# Altium project AudioUSB.PrjPcb
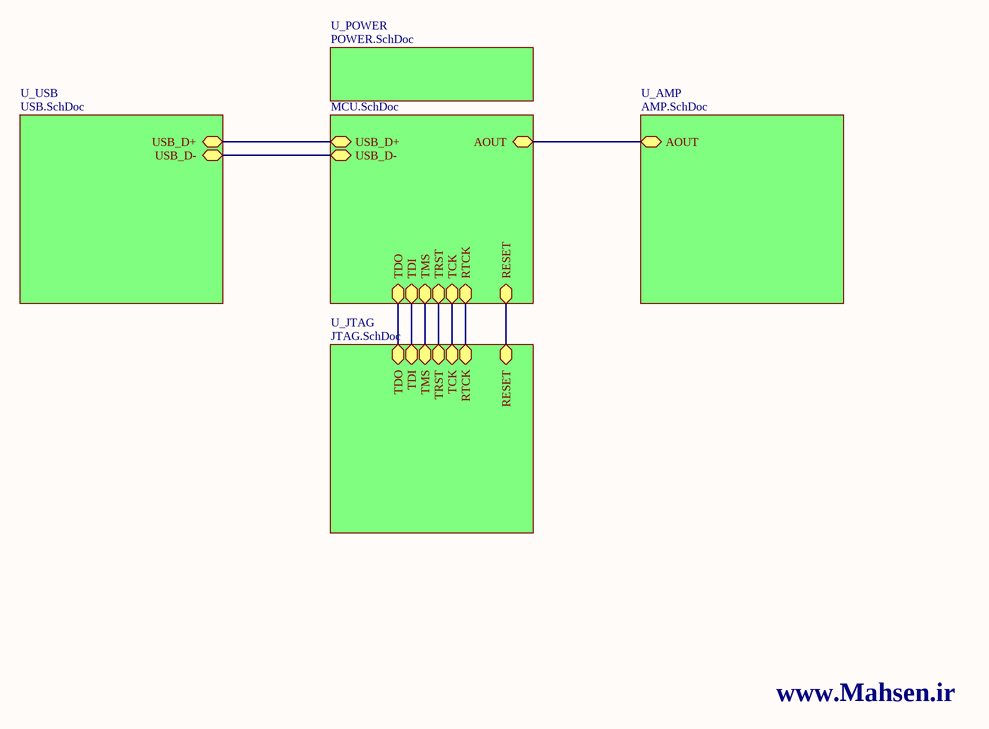
[diagram p0: TopSheet.SchDoc]
6 sheets, 41 parts. Net scope: hierarchical (ports join the sheet entries above them; power ports are global).
Board file: MainPCB.PcbDoc
Sheets:
  TopSheet.SchDoc
    U_AMP = AMP.SchDoc
    U_JTAG = JTAG.SchDoc
    U_MCU = MCU.SchDoc
    U_POWER = POWER.SchDoc
    U_USB = USB.SchDoc

## Sheet TopSheet.SchDoc
size A

### Sub-sheets
U_AMP = AMP.SchDoc: AOUT (bidir)
U_JTAG = JTAG.SchDoc: TDO (bidir), TDI (bidir), TMS (bidir), TRST (bidir), TCK (bidir), RTCK (bidir), RESET (bidir)
U_MCU = MCU.SchDoc: AOUT (bidir), USB_D+ (bidir), USB_D- (bidir), TDO (bidir), TDI (bidir), TMS (bidir), TRST (bidir), TCK (bidir), RTCK (bidir), RESET (bidir)
U_POWER = POWER.SchDoc: no entries
U_USB = USB.SchDoc: USB_D+ (bidir), USB_D- (bidir)

### Nets
NetC1_2: sheet U_AMP/AOUT, sheet U_MCU/AOUT
NetC5_1: sheet U_JTAG/RESET, sheet U_MCU/RESET
NetC17_2: sheet U_MCU/USB_D-, sheet U_USB/USB_D-
NetC18_1: sheet U_MCU/USB_D+, sheet U_USB/USB_D+
NetCN1_3: sheet U_JTAG/TRST, sheet U_MCU/TRST
NetCN1_5: sheet U_JTAG/TDI, sheet U_MCU/TDI
NetCN1_7: sheet U_JTAG/TMS, sheet U_MCU/TMS
NetCN1_9: sheet U_JTAG/TCK, sheet U_MCU/TCK
NetCN1_11: sheet U_JTAG/RTCK, sheet U_MCU/RTCK
NetCN1_13: sheet U_JTAG/TDO, sheet U_MCU/TDO

### Notes on the sheet
- www.Mahsen.ir

## Sheet AMP.SchDoc
size A
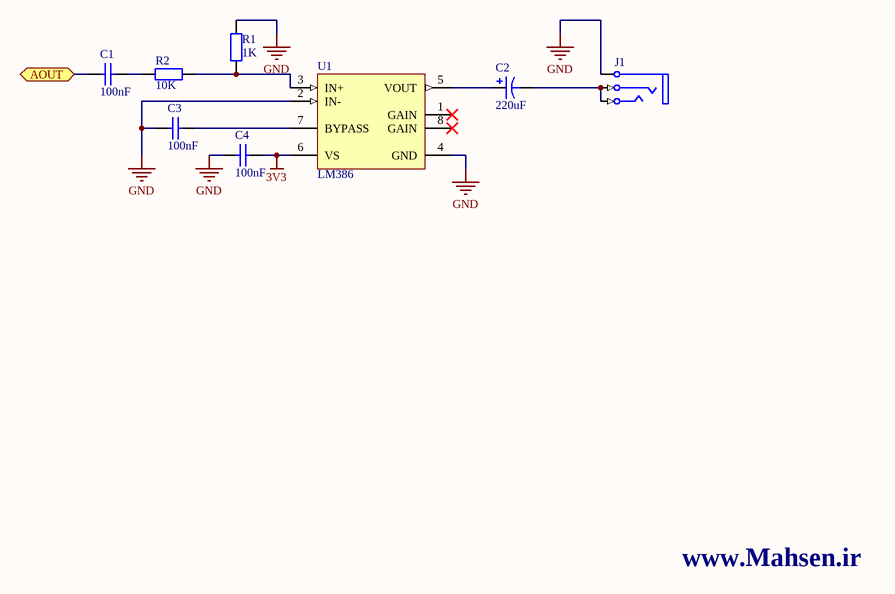
[diagram p1: AMP.SchDoc]

### Parts
C1  100nF  [0805]
C2  220uF  [CAPR5-4X5]
C3  100nF  [0805]
C4  100nF  [0805]
J1  Phonejack3  [KLD-0202]  (value not drawn)
R1  1K  [0805]
R2  10K  [0805]
U1  LM386  [M08A_L]

### Ports
AOUT (bidir)

### Nets
3V3: C4.1 U1.6(VS)
GND: C3.2 C4.2 J1.5(S) R1.2 U1.2(IN-) U1.4(GND)
NetC1_1: C1.1 R2.1
NetC1_2: C1.2 ; port AOUT
NetC2_1: C2.1 U1.5(VOUT)
NetC2_2: C2.2 J1.1(T) J1.3(R)
NetC3_1: C3.1 U1.7(BYPASS)
NetR1_1: R1.1 R2.2 U1.3(IN+)

Not connected (* = marked no-connect by the designer): U1 1(GAIN)* 8(GAIN)*

### Notes on the sheet
- www.Mahsen.ir

### Library data of the parts
C1 C3 C4 = Cap: Capacitor; Published: 8-Jun-2000; LatestRevisionDate: 17-Jul-2002; LatestRevisionNote: Re-released for DXP Platform.; PackageReference: RAD-0.3; Publisher: Altium Limited; PackageDescription: Radial Cap, Thru-Hole; 2 Leads; 0.3 in Pin Spacing; Value: 100nF
C2 = Cap Pol3: Polarized Capacitor (Surface Mount); Published: 8-Jun-2000; LatestRevisionDate: 29-May-2009; LatestRevisionNote: IPC-7351 Footprint Added.; PackageReference: C0805; Publisher: Altium Limited; PackageDescription: Chip Capacitor; Value: 220uF
J1 = Phonejack3: Jack Socket, 1/4" [6.5mm], Thru-Hole, Vertical, 3-Conductor Open Circuit (Non-Normalling); PackageDocument: 2003; PCB_Layout: Complies with manufacturer's recommendation.; DrillAndSlotSize: Corresponds to nominal value.; Published: 15-Jul-2004; LatestRevisionDate: 15-Jul-2004; LatestRevisionNote: Component Replaced.; DatasheetDocument: 2003; PackageReference: S1VS_SSS; Publisher: Altium Limited; ComponentLink1Description: Manufacturer Link; ComponentLink1URL: http://www.cliffuk.co.uk/
R1 R2 = Res2: Resistor; Published: 8-Jun-2000; LatestRevisionDate: 17-Jul-2002; LatestRevisionNote: Re-released for DXP Platform.; PackageReference: AXIAL-0.4; Publisher: Altium Limited; PackageDescription: Axial Device, Thru-Hole; 2 Leads; 0.4 in Pin Spacing
  R1: Value: 1K
  R2: Value: 10K
U1 = LM386MX-1: Low Voltage Audio Power Amplifier, 8-pin Narrow SOIC; Manufacturer: National Semiconductor; PackageTopMarking: NSZXTT*LM386*M-1; PowerWise: N; CompType: Audio IC; Published: 1-Mar-2010; DatasheetVersion: Aug-2000; PackageVersion: revM, May-2009; PackageReference: M08A; Publisher: Altium Limited; PackageDescription: SOIC Narrow, 4.9 x 3.9 x 1.45mm, 8 Lead, 1.27mm Pitch; PartNumber: LM386MX-1; RoHS: N; PinCount: 8; Code_JEDEC: MS-012-AA; Code_IPC: SOIC127P600-8; ComponentLink1Description: LM386 Datasheet; ComponentLink1URL: http://www.national.com/ds/LM/LM386.pdf; ComponentLink2Description: LM386 Web Page; ComponentLink2URL: http://www.national.com/pf/LM/LM386.html; ComponentLink3Description: M08A Package Page; ComponentLink3URL: http://www.national.com/packaging/folders/m08a.html

## Sheet JTAG.SchDoc
size A
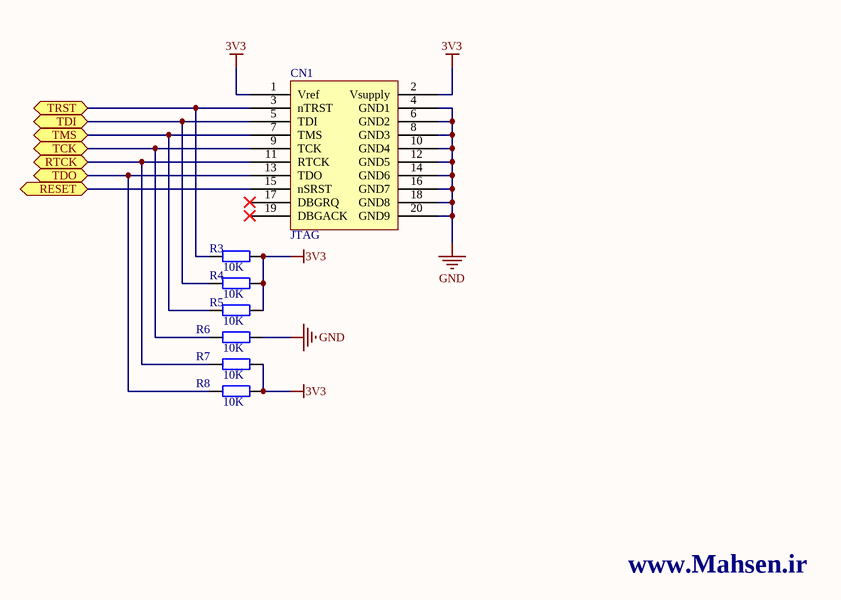
[diagram p2: JTAG.SchDoc]

### Parts
CN1  JTAG  [FKV20SN]
R3  10K  [0805]
R4  10K  [0805]
R5  10K  [0805]
R6  10K  [0805]
R7  10K  [0805]
R8  10K  [0805]

### Ports
RESET (bidir), RTCK (bidir), TCK (bidir), TDI (bidir), TDO (bidir), TMS (bidir), TRST (bidir)

### Nets
3V3: CN1.1(Vref) CN1.2(Vsupply) R3.1 R4.1 R5.1 R7.1 R8.1
GND: CN1.4(GND1) CN1.6(GND2) CN1.8(GND3) CN1.10(GND4) CN1.12(GND5) CN1.14(GND6) CN1.16(GND7) CN1.18(GND8) CN1.20(GND9) R6.1
NetC5_1: CN1.15(nSRST) ; port RESET
NetCN1_3: CN1.3(nTRST) R3.2 ; port TRST
NetCN1_5: CN1.5(TDI) R4.2 ; port TDI
NetCN1_7: CN1.7(TMS) R5.2 ; port TMS
NetCN1_9: CN1.9(TCK) R6.2 ; port TCK
NetCN1_11: CN1.11(RTCK) R7.2 ; port RTCK
NetCN1_13: CN1.13(TDO) R8.2 ; port TDO

Not connected (* = marked no-connect by the designer): CN1 17(DBGRQ)* 19(DBGACK)*

### Notes on the sheet
- www.Mahsen.ir

### Library data of the parts
R3-R8 = Res2: Resistor; Published: 8-Jun-2000; LatestRevisionDate: 17-Jul-2002; LatestRevisionNote: Re-released for DXP Platform.; PackageReference: AXIAL-0.4; Publisher: Altium Limited; PackageDescription: Axial Device, Thru-Hole; 2 Leads; 0.4 in Pin Spacing; Value: 10K

## Sheet MCU.SchDoc
size A4
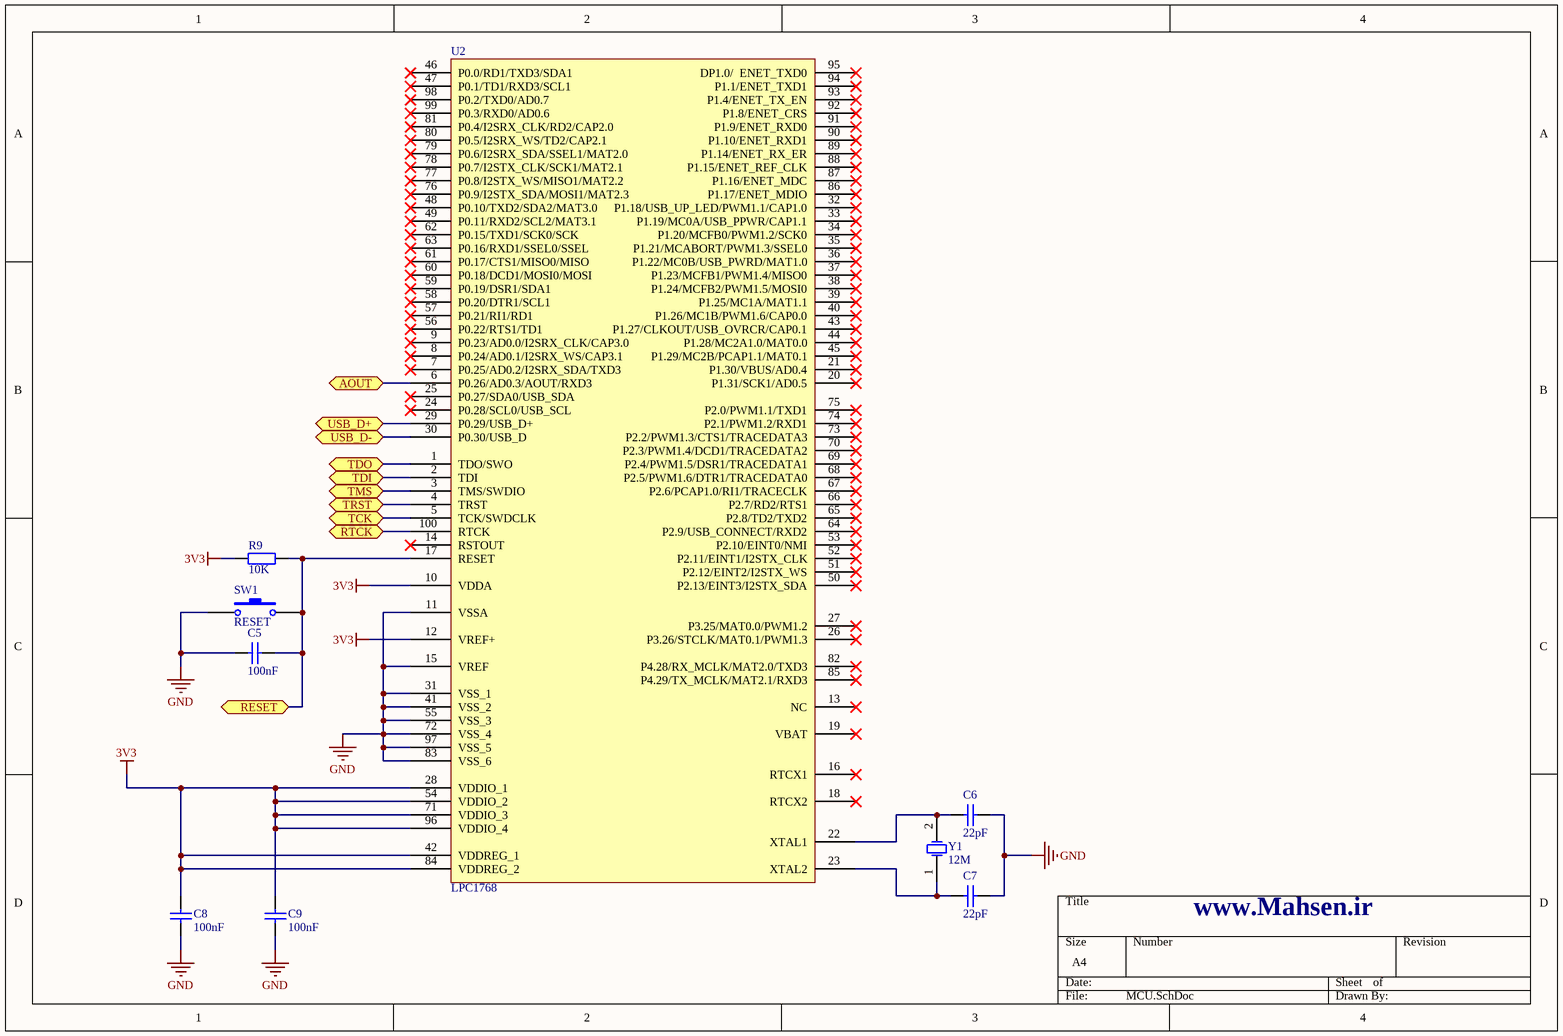
[diagram p3: MCU.SchDoc]

### Parts
C5  100nF  [0805]
C6  22pF  [0805]
C7  22pF  [0805]
C8  100nF  [0805]
C9  100nF  [0805]
R9  10K  [0805]
SW1  RESET  [SPST-2]
U2  LPC1768  [LQFP_100]
Y1  12M  [XTALA]

### Ports
AOUT (bidir), RESET (bidir), RTCK (bidir), TCK (bidir), TDI (bidir), TDO (bidir), TMS (bidir), TRST (bidir), USB_D+ (bidir), USB_D- (bidir)

### Nets
3V3: C8.1 C9.1 R9.1 U2.10(VDDA) U2.12(VREF+) U2.28(VDDIO_1) U2.42(VDDREG_1) U2.54(VDDIO_2) U2.71(VDDIO_3) U2.84(VDDREG_2) U2.96(VDDIO_4)
GND: C5.2 C6.2 C7.1 C8.2 C9.2 SW1.1 U2.11(VSSA) U2.15(VREF) U2.31(VSS_1) U2.41(VSS_2) U2.55(VSS_3) U2.72(VSS_4) U2.83(VSS_6) U2.97(VSS_5)
NetC1_2: U2.6(P0.26/AD0.3/AOUT/RXD3) ; port AOUT
NetC5_1: C5.1 R9.2 SW1.2 U2.17(RESET) ; port RESET
NetC6_1: C6.1 U2.22(XTAL1) Y1.2(OSC2)
NetC7_2: C7.2 U2.23(XTAL2) Y1.1(OSC1)
NetC17_2: U2.30(P0.30/USB_D) ; port USB_D-
NetC18_1: U2.29(P0.29/USB_D+) ; port USB_D+
NetCN1_3: U2.4(TRST) ; port TRST
NetCN1_5: U2.2(TDI) ; port TDI
NetCN1_7: U2.3(TMS/SWDIO) ; port TMS
NetCN1_9: U2.5(TCK/SWDCLK) ; port TCK
NetCN1_11: U2.100(RTCK) ; port RTCK
NetCN1_13: U2.1(TDO/SWO) ; port TDO

Not connected (* = marked no-connect by the designer): U2 7(P0.25/AD0.2/I2SRX_SDA/TXD3)* 8(P0.24/AD0.1/I2SRX_WS/CAP3.1)* 9(P0.23/AD0.0/I2SRX_CLK/CAP3.0)* 13(NC)* 14(RSTOUT)* 16(RTCX1)* 18(RTCX2)* 19(VBAT)* 20(P1.31/SCK1/AD0.5)* 21(P1.30/VBUS/AD0.4)* 24(P0.28/SCL0/USB_SCL)* 25(P0.27/SDA0/USB_SDA)* 26(P3.26/STCLK/MAT0.1/PWM1.3)* 27(P3.25/MAT0.0/PWM1.2)* 32(P1.18/USB_UP_LED/PWM1.1/CAP1.0)* 33(P1.19/MC0A/USB_PPWR/CAP1.1)* 34(P1.20/MCFB0/PWM1.2/SCK0)* 35(P1.21/MCABORT/PWM1.3/SSEL0)* 36(P1.22/MC0B/USB_PWRD/MAT1.0)* 37(P1.23/MCFB1/PWM1.4/MISO0)* 38(P1.24/MCFB2/PWM1.5/MOSI0)* 39(P1.25/MC1A/MAT1.1)* 40(P1.26/MC1B/PWM1.6/CAP0.0)* 43(P1.27/CLKOUT/USB_OVRCR/CAP0.1)* 44(P1.28/MC2A1.0/MAT0.0)* 45(P1.29/MC2B/PCAP1.1/MAT0.1)* 46(P0.0/RD1/TXD3/SDA1)* 47(P0.1/TD1/RXD3/SCL1)* 48(P0.10/TXD2/SDA2/MAT3.0)* 49(P0.11/RXD2/SCL2/MAT3.1)* 50(P2.13/EINT3/I2STX_SDA)* 51(P2.12/EINT2/I2STX_WS)* 52(P2.11/EINT1/I2STX_CLK)* 53(P2.10/EINT0/NMI)* 56(P0.22/RTS1/TD1)* 57(P0.21/RI1/RD1)* 58(P0.20/DTR1/SCL1)* 59(P0.19/DSR1/SDA1)* 60(P0.18/DCD1/MOSI0/MOSI)* 61(P0.17/CTS1/MISO0/MISO)* 62(P0.15/TXD1/SCK0/SCK)* 63(P0.16/RXD1/SSEL0/SSEL)* 64(P2.9/USB_CONNECT/RXD2)* 65(P2.8/TD2/TXD2)* 66(P2.7/RD2/RTS1)* 67(P2.6/PCAP1.0/RI1/TRACECLK)* 68(P2.5/PWM1.6/DTR1/TRACEDATA0)* 69(P2.4/PWM1.5/DSR1/TRACEDATA1)* 70(P2.3/PWM1.4/DCD1/TRACEDATA2)* 73(P2.2/PWM1.3/CTS1/TRACEDATA3)* 74(P2.1/PWM1.2/RXD1)* 75(P2.0/PWM1.1/TXD1)* 76(P0.9/I2STX_SDA/MOSI1/MAT2.3)* 77(P0.8/I2STX_WS/MISO1/MAT2.2)* 78(P0.7/I2STX_CLK/SCK1/MAT2.1)* 79(P0.6/I2SRX_SDA/SSEL1/MAT2.0)* 80(P0.5/I2SRX_WS/TD2/CAP2.1)* 81(P0.4/I2SRX_CLK/RD2/CAP2.0)* 82(P4.28/RX_MCLK/MAT2.0/TXD3)* 85(P4.29/TX_MCLK/MAT2.1/RXD3)* 86(P1.17/ENET_MDIO)* 87(P1.16/ENET_MDC)* 88(P1.15/ENET_REF_CLK)* 89(P1.14/ENET_RX_ER)* 90(P1.10/ENET_RXD1)* 91(P1.9/ENET_RXD0)* 92(P1.8/ENET_CRS)* 93(P1.4/ENET_TX_EN)* 94(P1.1/ENET_TXD1)* 95(DP1.0/__ENET_TXD0)* 98(P0.2/TXD0/AD0.7)* 99(P0.3/RXD0/AD0.6)*

### Notes on the sheet
- www.Mahsen.ir

### Library data of the parts
C5-C9 = Cap: Capacitor; Published: 8-Jun-2000; LatestRevisionDate: 17-Jul-2002; LatestRevisionNote: Re-released for DXP Platform.; PackageReference: RAD-0.3; Publisher: Altium Limited; PackageDescription: Radial Cap, Thru-Hole; 2 Leads; 0.3 in Pin Spacing
  C5 C8 C9: Value: 100nF
  C6 C7: Value: 22pF
R9 = Res2: Resistor; Published: 8-Jun-2000; LatestRevisionDate: 17-Jul-2002; LatestRevisionNote: Re-released for DXP Platform.; PackageReference: AXIAL-0.4; Publisher: Altium Limited; PackageDescription: Axial Device, Thru-Hole; 2 Leads; 0.4 in Pin Spacing; Value: 10K
SW1 = SW-PB: Switch; Published: 24-Mar-1999; LatestRevisionDate: 17-Jul-2002; LatestRevisionNote: Re-released for DXP Platform.; PackageReference: SPST-2; Publisher: Altium Limited; PackageDescription: Switch; 2 Leads
Y1 = XTAL: Crystal Oscillator; Published: 8-Jun-2000; LatestRevisionDate: 17-Jul-2002; LatestRevisionNote: Re-released for DXP Platform.; PackageReference: R38; Publisher: Altium Limited; PackageDescription: Crystal, Thru-Hole; 2 Leads; Body 3.1 x 8.2 mm (Dia.xH); Value: 12M

## Sheet POWER.SchDoc
size A
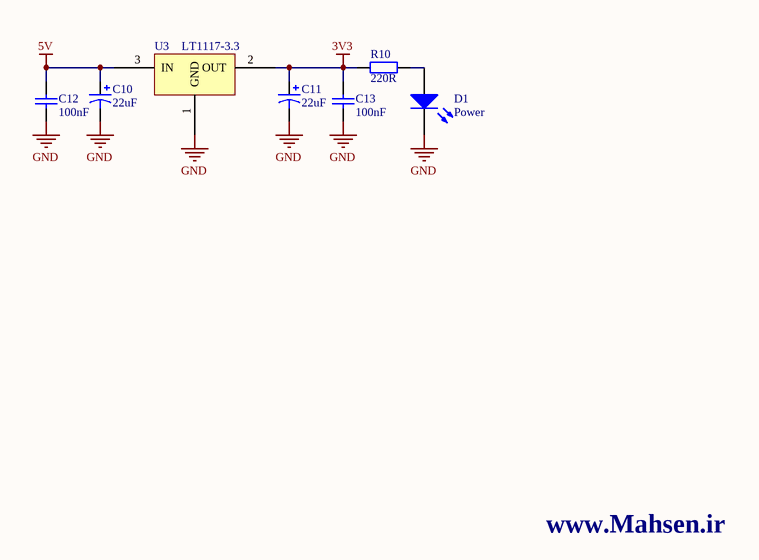
[diagram p4: POWER.SchDoc]

### Parts
C10  22uF  [CAPR5-4X5]
C11  22uF  [CAPR5-4X5]
C12  100nF  [0805]
C13  100nF  [0805]
D1  Power  [3.5X2.8X1.9]
R10  220R  [0805]
U3  LT1117-3.3  [SOT223_4]

### Nets
3V3: C11.1 C13.1 R10.1 U3.2(OUT)
5V: C10.1 C12.1 U3.3(IN)
GND: C10.2 C11.2 C12.2 C13.2 D1.2(K) U3.1(GND)
NetD1_1: D1.1(A) R10.2

### Notes on the sheet
- www.Mahsen.ir

### Library data of the parts
C10 C11 = Cap Pol3: Polarized Capacitor (Surface Mount); Published: 8-Jun-2000; LatestRevisionDate: 29-May-2009; LatestRevisionNote: IPC-7351 Footprint Added.; PackageReference: C0805; Publisher: Altium Limited; PackageDescription: Chip Capacitor; Value: 22uF
C12 C13 = Cap: Capacitor; Published: 8-Jun-2000; LatestRevisionDate: 17-Jul-2002; LatestRevisionNote: Re-released for DXP Platform.; PackageReference: RAD-0.3; Publisher: Altium Limited; PackageDescription: Radial Cap, Thru-Hole; 2 Leads; 0.3 in Pin Spacing; Value: 100nF
D1 = LED3: Typical BLUE SiC LED; Published: 8-Jun-2000; LatestRevisionDate: 17-Dec-2003; LatestRevisionNote: PCB Footprint replaced.; DatasheetVersion: 16-Apr-2002; PackageVersion: 16-Apr-2002; PackageReference: 3.5X2.8X1.9; Publisher: Altium Limited; PackageDescription: SM LED; 2 C-Bend Leads; Body 3.5 x 2.8 x 1.9 mm, inc leads (LxWxH typ)
R10 = Res2: Resistor; Published: 8-Jun-2000; LatestRevisionDate: 17-Jul-2002; LatestRevisionNote: Re-released for DXP Platform.; PackageReference: AXIAL-0.4; Publisher: Altium Limited; PackageDescription: Axial Device, Thru-Hole; 2 Leads; 0.4 in Pin Spacing; Value: 220R

## Sheet USB.SchDoc
size A
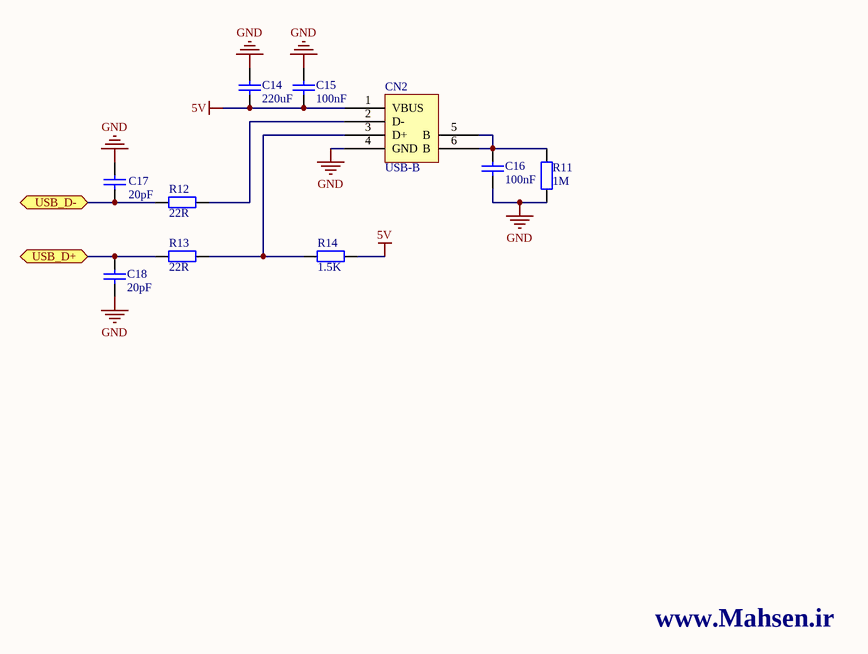
[diagram p5: USB.SchDoc]

### Parts
C14  220uF  [0805]
C15  100nF  [0805]
C16  100nF  [0805]
C17  20pF  [0805]
C18  20pF  [0805]
CN2  USB-B  [CONN_USB]
R11  1M  [0805]
R12  22R  [0805]
R13  22R  [0805]
R14  1.5K  [0805]

### Ports
USB_D+ (bidir), USB_D- (bidir)

### Nets
5V: C14.2 C15.2 CN2.1(VBUS) R14.2
GND: C14.1 C15.1 C16.2 C17.1 C18.2 CN2.4(GND) R11.1
NetC16_1: C16.1 CN2.5(B) CN2.6(B) R11.2
NetC17_2: C17.2 R12.2 ; port USB_D-
NetC18_1: C18.1 R13.2 ; port USB_D+
NetCN2_2: CN2.2(D-) R12.1
NetCN2_3: CN2.3(D+) R13.1 R14.1

### Notes on the sheet
- www.Mahsen.ir

### Library data of the parts
C14-C18 = Cap: Capacitor; Published: 8-Jun-2000; LatestRevisionDate: 17-Jul-2002; LatestRevisionNote: Re-released for DXP Platform.; PackageReference: RAD-0.3; Publisher: Altium Limited; PackageDescription: Radial Cap, Thru-Hole; 2 Leads; 0.3 in Pin Spacing
  C14: Value: 220uF
  C15 C16: Value: 100nF
  C17 C18: Value: 20pF
R11-R14 = Res2: Resistor; Published: 8-Jun-2000; LatestRevisionDate: 17-Jul-2002; LatestRevisionNote: Re-released for DXP Platform.; PackageReference: AXIAL-0.4; Publisher: Altium Limited; PackageDescription: Axial Device, Thru-Hole; 2 Leads; 0.4 in Pin Spacing
  R11: Value: 1M
  R12 R13: Value: 22R
  R14: Value: 1.5K

## Nets that join several sheets
3V3: AMP (C4.1 U1.6), JTAG (7 pins), MCU (11 pins), POWER (C11.1 C13.1 R10.1 U3.2)
5V: POWER (C10.1 C12.1 U3.3), USB (C14.2 C15.2 CN2.1 R14.2)
GND: AMP (6 pins), JTAG (10 pins), MCU (14 pins), POWER (6 pins), USB (7 pins)
NetC1_2: AMP (C1.2), MCU (U2.6)
NetC5_1: JTAG (CN1.15), MCU (C5.1 R9.2 SW1.2 U2.17)
NetC17_2: MCU (U2.30), USB (C17.2 R12.2)
NetC18_1: MCU (U2.29), USB (C18.1 R13.2)
NetCN1_3: JTAG (CN1.3 R3.2), MCU (U2.4)
NetCN1_5: JTAG (CN1.5 R4.2), MCU (U2.2)
NetCN1_7: JTAG (CN1.7 R5.2), MCU (U2.3)
NetCN1_9: JTAG (CN1.9 R6.2), MCU (U2.5)
NetCN1_11: JTAG (CN1.11 R7.2), MCU (U2.100)
NetCN1_13: JTAG (CN1.13 R8.2), MCU (U2.1)